# EAGLE design HES_Board_Rev1 (EAGLE 7.3.0)
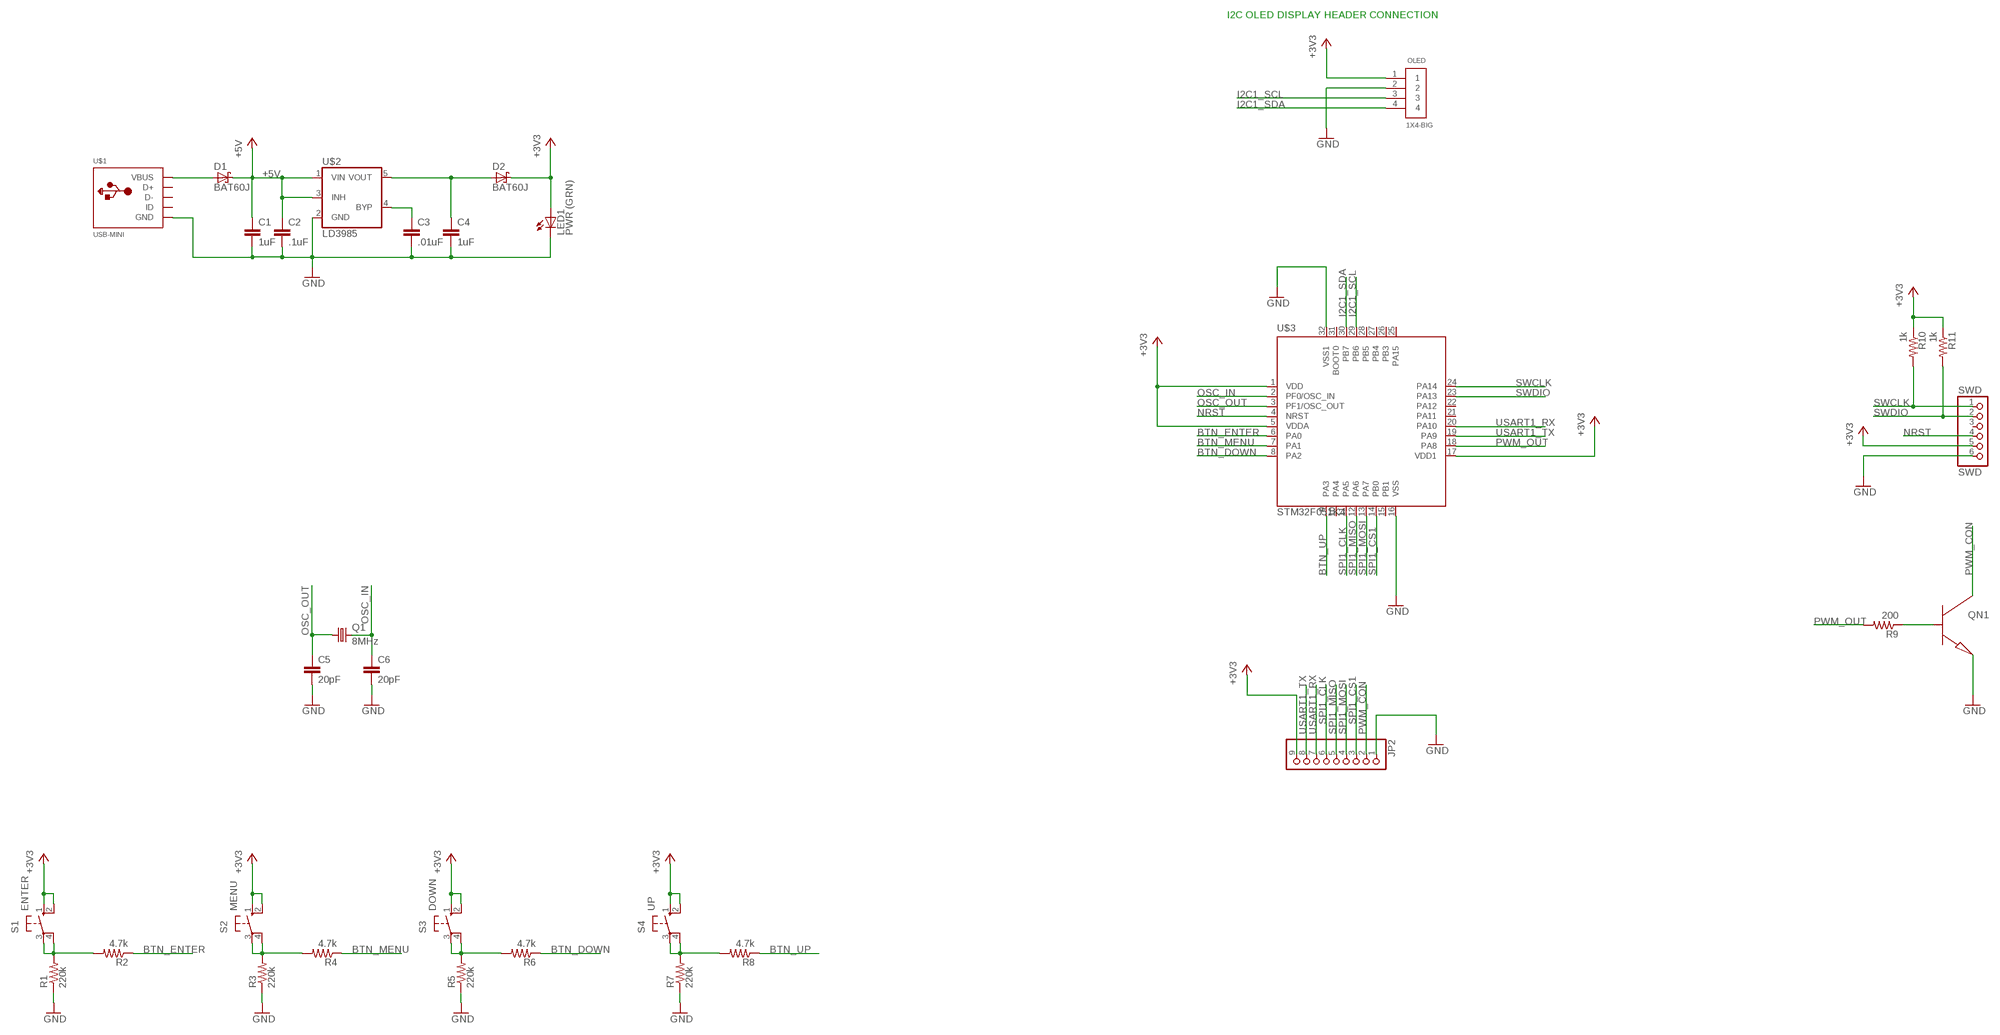
[diagram p0: schematic, sheet 1]

## Parts
C1  1uF  C-EUC0805  [C0805]
C2  .1uF  C-EUC0805  [C0805]
C3  .01uF  C-EUC0805  [C0805]
C4  1uF  C-EUC0805  [C0805]
C5  20pF  C-EUC0805  [C0805]
C6  20pF  C-EUC0805  [C0805]
D1  BAT60J  [SOD323_ST]
D2  BAT60J  [SOD323_ST]
JP2  PINHD-1X9  [1X09-BIG]
LED1  PWR (GRN)  LEDCHIP-LED0805  [CHIP-LED0805]
OLED  1X4-BIG  [1X04-BIG]
Q1  8MHz  CRYSTALHC49S  [HC49/S]
QN1  NPN  [SOT23]
R1  220k  R-US_R0805  [R0805]
R2  4.7k  R-US_R0805  [R0805]
R3  220k  R-US_R0805  [R0805]
R4  4.7k  R-US_R0805  [R0805]
R5  220k  R-US_R0805  [R0805]
R6  4.7k  R-US_R0805  [R0805]
R7  220k  R-US_R0805  [R0805]
R8  4.7k  R-US_R0805  [R0805]
R9  200  R-US_R0805  [R0805]
R10  1k  R-US_R0805  [R0805]
R11  1k  R-US_R0805  [R0805]
S1  ENTER  10-XX  [B3F-10XX]
S2  MENU  10-XX  [B3F-10XX]
S3  DOWN  10-XX  [B3F-10XX]
S4  UP  10-XX  [B3F-10XX]
SWD  SWD  PINHD-1X6B  [1X06-BIG]
U$1  USB-MINI  [USB-MINI]
U$2  LD3985  [SOT23-5L]
U$3  STM32F051K4  [LQFP32-7X7]

## Nets
+3V3: D2.C JP2.9 LED1.A OLED.1 R10.1 R11.1 S1.1(S) S1.2(S1) S2.1(S) S2.2(S1) S3.1(S) S3.2(S1) S4.1(S) S4.2(S1) SWD.5 U$3.1(VDD) U$3.5(VDDA) U$3.17(VDD1)
+5V: C1.1 C2.1 D1.C U$2.1(VIN) U$2.3(INH)
BTN_DOWN: R6.1 U$3.8(PA2)
BTN_ENTER: R2.1 U$3.6(PA0)
BTN_MENU: R4.1 U$3.7(PA1)
BTN_UP: R8.1 U$3.9(PA3)
GND: C1.2 C2.2 C3.2 C4.2 C5.2 C6.2 JP2.1 LED1.C OLED.2 QN1.1(E) R1.1 R3.1 R5.1 R7.1 SWD.6 U$1.GND U$2.2(GND) U$3.16(VSS) U$3.32(VSS1)
I2C1_SCL: OLED.3 U$3.29(PB6)
I2C1_SDA: OLED.4 U$3.30(PB7)
N$1: D1.A U$1.VBUS
N$2: C4.1 D2.A U$2.5(VOUT)
N$3: R5.2 R6.2 S3.3(P) S3.4(P1)
N$4: R1.2 R2.2 S1.3(P) S1.4(P1)
N$5: C3.1 U$2.4(BYP)
N$6: R7.2 R8.2 S4.3(P) S4.4(P1)
N$7: R3.2 R4.2 S2.3(P) S2.4(P1)
N$8: QN1.2(B) R9.1
NRST: SWD.4 U$3.4(NRST)
OSC_IN: C6.1 Q1.2 U$3.2(PF0/OSC_IN)
OSC_OUT: C5.1 Q1.1 U$3.3(PF1/OSC_OUT)
PWM_CON: JP2.2 QN1.3(C)
PWM_OUT: R9.2 U$3.18(PA8)
SPI1_CLK: JP2.6 U$3.11(PA5)
SPI1_CS1: JP2.3 U$3.14(PB0)
SPI1_MISO: JP2.5 U$3.12(PA6)
SPI1_MOSI: JP2.4 U$3.13(PA7)
SWCLK: R10.2 SWD.1 U$3.24(PA14)
SWDIO: R11.2 SWD.2 U$3.23(PA13)
USART1_RX: JP2.7 U$3.20(PA10)
USART1_TX: JP2.8 U$3.19(PA9)
Unconnected: SWD.3 U$1.D+ U$1.D- U$1.ID U$3.10(PA4) U$3.15(PB1) U$3.21(PA11) U$3.22(PA12) U$3.25(PA15) U$3.26(PB3) U$3.27(PB4) U$3.28(PB5) U$3.31(BOOT0)

## Notes on the sheet
- I2C OLED DISPLAY HEADER CONNECTION

## Library data of the parts
C1-C6 = resistor:C-EU: CAPACITOR, European symbol
D1 D2 = User-Custom:BAT60J: Schottky barrier diode Source: www.st.com, BAT60J.pdf
JP2 = adafruit:PINHD-1X9: Pin header 1x10 0.1" spacing With round pins
LED1 = adafruit:LED: LED OSRAM: - CHIPLED LG R971, LG N971, LY N971, LG Q971, LY Q971, LO R971, LY R971 LH N974, LH R974 LS Q976, LO Q976, LY Q976 LO Q996 - Hyper CHIPLED LW Q18S LB Q993, LB Q99A, LB R99A - SideLED LS A670, LO A670, LY A670, LG A670, LP A670 LB A673, LV A673, LT A673, LW A673 LH A674 LY A675 LS A676, LA A676, LO A676, LY A676, LW A676 LS A679, LY A679, LG A679 - Hyper Micro SIDELED® LS Y876, LA Y876, LO Y876, LY Y876 LT Y87S - SmartLED LW L88C, LW L88S LB L89C, LB L89S, LG L890 LS L89K, LO L89K, LY L89K LS L896, LA L896, LO L896, LY L896 - TOPLED LS T670, LO T670, LY T670, LG T670, LP T670 LSG T670, LSP T670, LSY T670, LOP T670, LYG T670 LG T671, LOG T671, LSG T671 LB T673, LV T673, LT T673, LW T673 LH T674 LS T676, LA T676, LO T676, LY T676, LB T676, LH T676, LSB T676, LW T676 LB T67C, LV T67C, LT T67C, LS T67K, LO T67K, LY T67K, LW E67C LS E67B, LA E67B, LO E67B, LY E67B, LB E67C, LV E67C, LT E67C LW T67C LS T679, LY T679, LG T679 LS T770, LO T770, LY T770, LG T770, LP T770 LB T773, LV T773, LT T773, LW T773 LH T774 LS E675, LA E675, LY E675, LS T675 LS T776, LA T776, LO T776, LY T776, LB T776 LHGB T686 LT T68C, LB T68C - Hyper Mini TOPLED® LB M676 - Mini TOPLED Santana® LG M470 LS M47K, LO M47K, LY M47K Source: http://www.osram.convergy.de/
OLED = adafruit:1X4: 4-pin connector
Q1 = User-Custom:CRYSTAL: CRYSTAL; OC_FARNELL: 1667008; OC_NEWARK: unknown
QN1 = User-Custom:NPN: Bipolar NPN transistor
R1-R11 = resistor:R-US_: RESISTOR, American symbol
S1-S4 = User-Custom:10-XX: OMRON SWITCH; MPN: B3F-1000; OC_FARNELL: 176432; OC_NEWARK: 36M3542
SWD = adafruit:PINHD-1X6: PIN HEADER
U$1 = User-Custom:USB-MINI: USB Mini Connector http://portal.fciconnect.com/Comergent//fci/drawing/10033526.pdf
U$2 = User-Custom:LD3985: LUltra low drop and low noise BiCMOS voltage regulators http://www.st.com/web/en/resource/technical/document/datasheet/CD00003395.pdf
U$3 = User-Custom:STM32F051K4

## Board
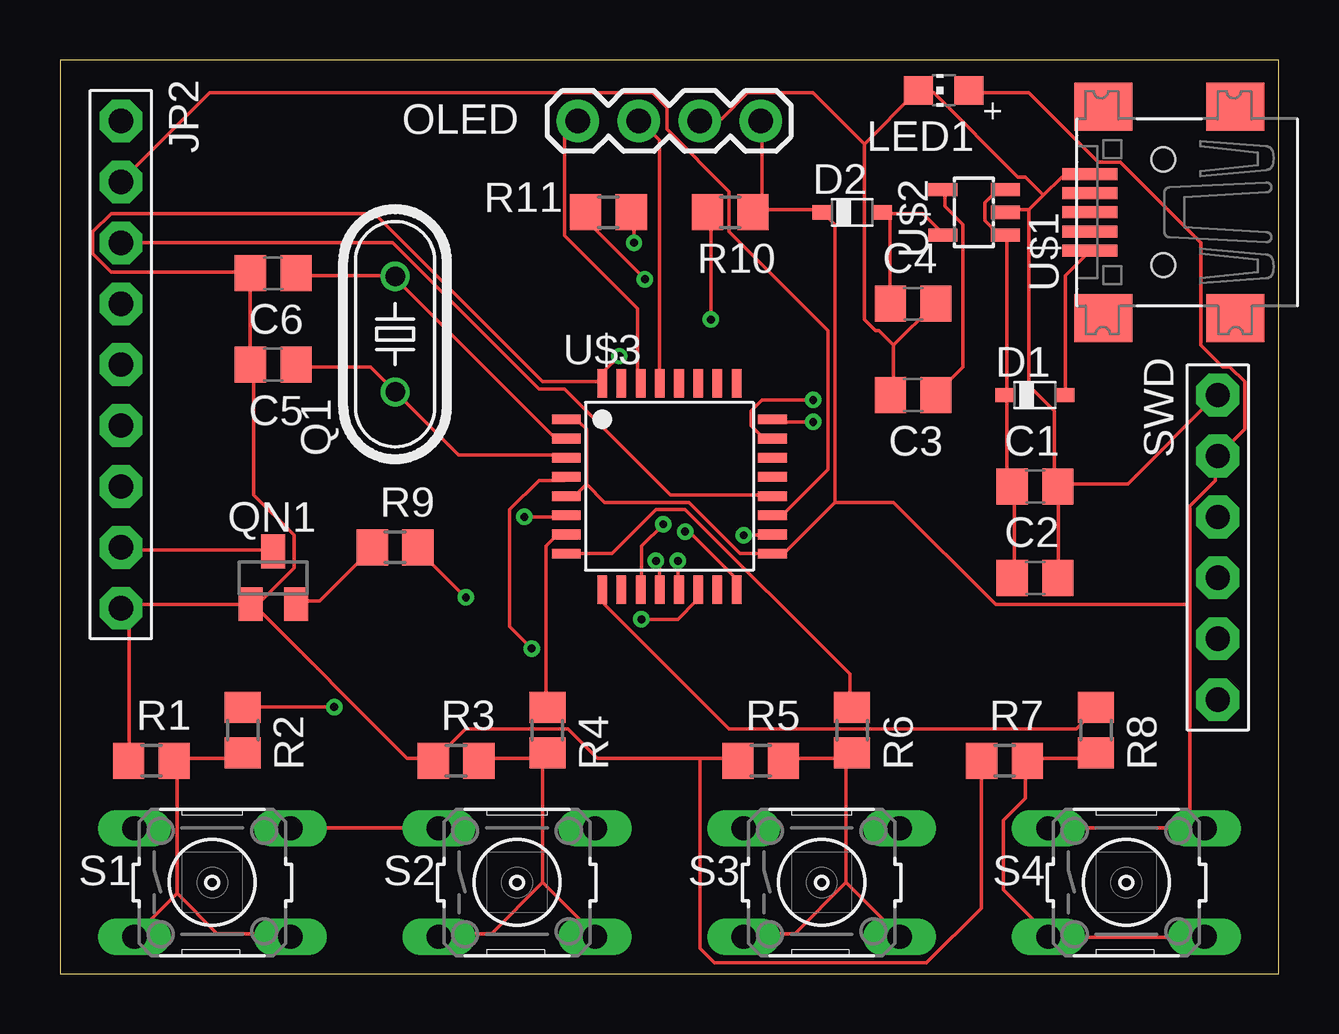
[diagram p1: board, top side]
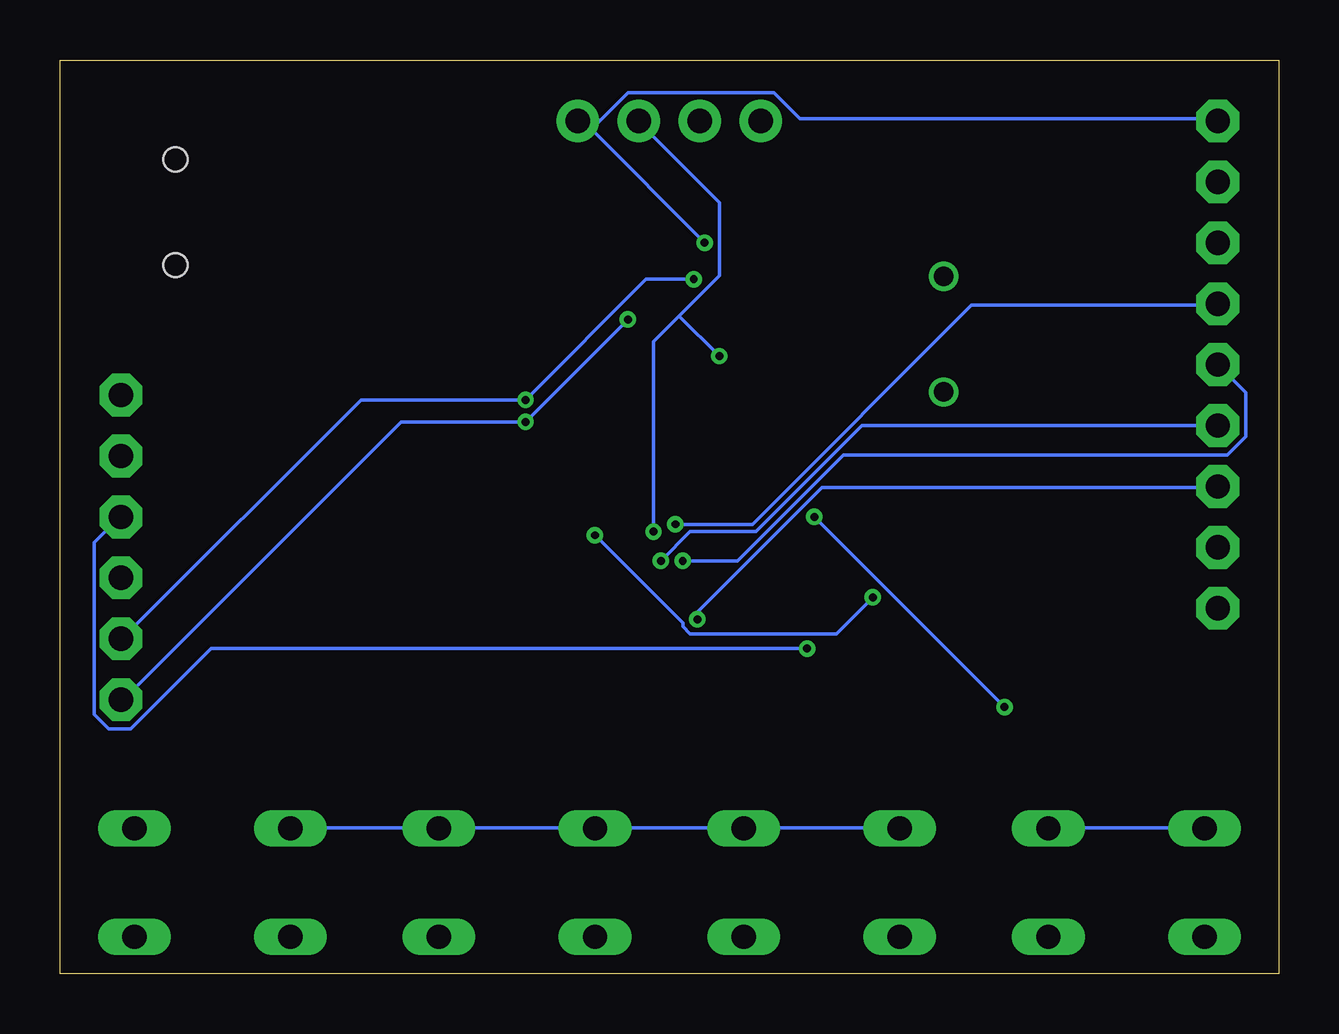
[diagram p2: board, bottom side, seen from below]

Size 50.8 x 38.1 mm. Coordinates in mm from the lower left corner, seen from the top.
Outline: 0,0 50.8,0 50.8,38.1 0,38.1 0,0
Copper layers (1*16): Top 0.0356mm / dielectric 1.5011mm / Bottom 0.0356mm
Design rules "LaenPCBOrder": minimum track width 6mil, minimum drill 13mil, track to track 6mil, track to pad 6mil, pad to pad 6mil, via to via 6mil, smd to smd 6mil, copper to edge 15mil, drill to drill 6mil, minimum pad ring 7mil, minimum via ring 7mil, stop-mask expansion 3mil, vias tented up to drill 0mil, thermal gap 10mil

### Footprints (pad centres in the part's own frame; a part is rotated, then mirrored left to right if it is on the bottom)
C0805 = smd 1.3 x 1.5: 1 -0.95,0; 2 0.95,0
SOD323_ST = smd 0.8 x 0.6: A 1.25,0; C -1.25,0
1X09-BIG = drill 1.016 pad 1.778 octagon: 1 -10.16,0; 2 -7.62,0; 3 -5.08,0; 4 -2.54,0; 5 0,0; 6 2.54,0; 7 5.08,0; 8 7.62,0; 9 10.16,0
CHIP-LED0805 = smd 1.2 x 1.2: A 0,-1.05; C 0,1.05
1X04-BIG = drill 1.016 pad 1.778: 1 0,0; 2 2.54,0; 3 5.08,0; 4 7.62,0
HC49/S = drill 0.813: 1 -2.413,0; 2 2.413,0
SOT23 = smd 1 x 1.4: 1 -0.95,-1.1; 2 0.95,-1.1; 3 0,1.1
R0805 = smd 1.3 x 1.5: 1 -0.95,0; 2 0.95,0
B3F-10XX = drill 1.016 long: 1 -3.251,2.261; 2 3.251,2.261; 3 -3.251,-2.261; 4 3.251,-2.261
1X06-BIG = drill 1.016 pad 1.778 octagon: 1 -6.35,0; 2 -3.81,0; 3 -1.27,0; 4 1.27,0; 5 3.81,0; 6 6.35,0
USB-MINI = smd 0.5 x 2.308: D+ 0,2.794; D- -0.8,2.794; GND 1.6,2.794; ID 0.8,2.794; VBUS -1.6,2.794 | smd 2 x 2.4: GND1 -4.4,-3.27; GND2 -4.4,2.23; GND3 4.4,2.23; GND4 4.4,-3.27 | hole 1: -2.2,-0.27; 2.2,-0.27
SOT23-5L = smd 0.55 x 1.2: 1 -0.95,-1.3; 2 0,-1.3; 3 0.95,-1.3; 4 0.95,1.3; 5 -0.95,1.3
LQFP32-7X7 = smd 1.2 x 0.4: 1 -4.3,2.8; 2 -4.3,2; 3 -4.3,1.2; 4 -4.3,0.4; 5 -4.3,-0.4; 6 -4.3,-1.2; 7 -4.3,-2; 8 -4.3,-2.8; 17 4.3,-2.8; 18 4.3,-2; 19 4.3,-1.2; 20 4.3,-0.4; 21 4.3,0.4; 22 4.3,1.2; 23 4.3,2; 24 4.3,2.8 | smd 0.4 x 1.2: 9 -2.8,-4.3; 10 -2,-4.3; 11 -1.2,-4.3; 12 -0.4,-4.3; 13 0.4,-4.3; 14 1.2,-4.3; 15 2,-4.3; 16 2.8,-4.3; 25 2.8,4.3; 26 2,4.3; 27 1.2,4.3; 28 0.4,4.3; 29 -0.4,4.3; 30 -1.2,4.3; 31 -2,4.3; 32 -2.8,4.3

### Placement (x,y rotation side)
C1  40.64,20.32 0 top
C2  40.64,16.51 0 top
C3  35.56,24.13 180 top
C4  35.56,27.94 0 top
C5  8.89,25.4 180 top
C6  8.89,29.21 180 top
D1  40.64,24.13 0 top
D2  33.02,31.75 0 top
JP2  2.54,25.4 90 top
LED1  36.83,36.83 90 top
OLED  29.21,35.56 180 top
Q1  13.97,26.67 90 top
QN1  8.89,16.51 0 top
R1  3.81,8.89 0 top
R2  7.62,10.16 270 top
R3  16.51,8.89 0 top
R4  20.32,10.16 270 top
R5  29.21,8.89 0 top
R6  33.02,10.16 270 top
R7  39.37,8.89 0 top
R8  43.18,10.16 270 top
R9  13.97,17.78 0 top
R10  27.94,31.75 180 top
R11  22.86,31.75 180 top
S1  6.35,3.81 0 top
S2  19.05,3.81 0 top
S3  31.75,3.81 0 top
S4  44.45,3.81 0 top
SWD  48.26,17.78 90 top
U$1  45.72,31.75 90 top
U$2  38.1,31.75 90 top
U$3  25.4,20.32 0 top

### Tracks (layer width: path | path; a pad name or v marks a point on that pad's centre or on a via)
+3V3  (via drill 0.33)
  Top 0.152: 21.95,20.42 21.49,19.96 21.18,19.96 U$3.5 | 21.95,20.42 21.95,22.71 21.64,23.01 21.18,23.01 U$3.1 | 21.95,20.42 22.71,19.66 26.21,19.66 28.35,17.53 29.57,17.53 U$3.17 29.72,17.53 30.18,17.53 32.31,19.66 | 29.26,31.85 28.96,31.85 R10.1 29.26,31.85 | 29.26,31.85 31.7,31.85 D2.C 31.85,31.7 32.31,31.24 32.31,19.66 | v23.93,30.48 23.93,31.7 R11.1 | 29.26,31.85 29.26,35.51 OLED.1 | LED1.A 37.95,36.73 40.39,36.73 43.28,33.83 44.2,33.83 47.55,30.48 47.55,26.21 48.46,25.3 48.77,25.3 49.38,24.69 49.38,22.71 SWD.5 48.16,21.49 48.16,20.57 47.09,19.51 47.09,15.39 | 47.09,6.1 41.3,6.1 S4.1 | 47.09,6.1 47.7,6.1 S4.2 47.09,6.1 | S2.1 15.7,6.1 9.6,6.1 S1.2 | 47.09,6.1 47.09,15.39 | 32.31,19.66 34.75,19.66 39.01,15.39 47.09,15.39
  Bottom 0.152: 28.65,35.2 29.11,35.66 OLED.1 28.65,35.2 | 28.65,35.2 v23.93,30.48 | 28.65,35.2 27.13,36.73 21.03,36.73 19.96,35.66 2.59,35.66 JP2.9 | S4.1 41.15,6.1 35.05,6.1 S3.2 34.9,6.1 28.5,6.1 | 28.5,6.1 22.4,6.1 S2.2 22.25,6.1 15.85,6.1 S2.1 | S1.1 3.2,6.1 9.6,6.1 S1.2 | 28.5,6.1 S3.1
+5V
  Top 0.152: U$2.3 39.32,32.61 39.01,32.61 38.56,32.16 38.56,31.39 39.01,30.94 39.32,30.94 U$2.1 39.47,30.79 39.47,24.23 D1.C 39.47,24.08 39.47,20.57 39.62,20.42 C1.1 39.78,20.27 39.78,16.61 C2.1
BTN_DOWN
  Top 0.152: U$3.8 21.18,17.53 23.01,17.53 24.84,19.36 26.06,19.36 32.92,12.5 32.92,11.12 R6.1
BTN_ENTER  (via drill 0.33)
  Top 0.152: v19.36,19.05 21.03,19.05 U$3.6 | v11.43,11.12 7.62,11.12 R2.1
  Bottom 0.152: v11.43,11.12 v19.36,19.05
BTN_MENU
  Top 0.152: U$3.7 21.03,18.29 20.73,18.29 20.27,17.83 20.27,11.12 R4.1
BTN_UP
  Top 0.152: U$3.9 22.71,16 22.71,15.39 27.89,10.21 42.37,10.21 43.13,10.97 R8.1
GND  (via drill 0.33)
  Top 0.152: v26.06,18.44 26.21,18.44 28.19,16.46 28.19,16.15 U$3.16 | C2.2 41.6,16.61 41.6,20.27 C1.2 | C1.2 41.6,20.42 44.5,20.42 48.16,24.08 SWD.6 | 34.75,26.21 34.75,24.23 C3.2 | 34.75,26.21 36.42,27.89 C4.2 | 40.39,31.85 39.47,31.85 U$2.2 | 41,32.46 41.76,33.22 42.82,33.22 U$1.GND | 41,32.46 40.39,31.85 | 41,32.46 40.23,33.22 39.93,33.22 36.42,36.73 35.81,36.73 LED1.C 35.66,36.73 33.53,34.59 | 34.75,26.21 34.14,26.82 33.98,26.82 33.53,27.28 33.53,34.59 | 40.39,31.85 40.39,24.54 41.45,23.47 41.45,20.42 C1.2 | 33.53,34.59 31.39,36.73 28.65,36.73 27.58,35.66 26.67,35.66 OLED.2 | 2.9,15.39 2.74,15.39 2.59,15.24 JP2.1 2.9,15.39 | 2.9,15.39 7.92,15.39 QN1.1 | 2.9,15.39 2.9,8.99 R1.1 | QN1.1 8.08,15.39 14.48,8.99 15.54,8.99 R3.1 15.7,8.99 16.92,10.21 21.18,10.21 22.4,8.99 26.67,8.99 | 26.67,8.99 28.19,8.99 R5.1 | 26.67,8.99 26.67,1.07 27.28,0.46 36.12,0.46 38.41,2.74 38.41,8.84 R7.1 | QN1.1 8.08,15.54 8.38,15.54 9.75,16.92 9.75,18.29 8.08,19.96 8.08,25.3 C5.2 7.92,25.45 7.92,29.11 C6.2 7.92,29.26 2.13,29.26 1.37,30.02 1.37,30.94 2.13,31.7 13.11,31.7 20.12,24.69 22.55,24.69 U$3.32 22.71,24.69 22.71,25.15 v23.32,25.76
  Bottom 0.152: v26.06,18.44 26.06,26.36 24.99,27.43 | 24.99,27.43 23.32,29.11 23.32,32.16 26.67,35.51 OLED.2 | v23.32,25.76 24.99,27.43
I2C1_SCL
  Top 0.152: U$3.29 24.99,24.69 24.99,34.75 24.23,35.51 OLED.3
I2C1_SDA
  Top 0.152: U$3.30 24.08,24.69 24.08,27.74 21.03,30.79 21.03,35.05 21.49,35.51 OLED.4
N$1
  Top 0.152: D1.A 41.91,24.23 41.91,29.11 42.82,30.02 U$1.VBUS
N$2
  Top 0.152: 34.59,31.7 35.97,31.7 36.73,30.94 U$2.5 | 34.59,31.7 34.29,31.7 D2.A 34.59,31.7 | 34.59,31.7 34.59,28.04 C4.1
N$3
  Top 0.152: 32.77,8.99 30.18,8.99 R5.2 | 32.77,8.99 32.92,9.14 R6.2 32.77,8.99 | 32.77,3.81 32.77,8.99 | 32.77,3.81 34.9,1.68 S3.4 | 32.77,3.81 30.63,1.68 28.5,1.68 S3.3
N$4
  Top 0.152: R2.2 7.62,9.14 7.47,8.99 4.88,8.99 R1.2 4.88,8.84 4.88,3.35 | 4.88,3.35 3.2,1.68 S1.3 | 4.88,3.35 6.55,1.68 9.6,1.68 S1.4
N$5
  Top 0.152: U$2.4 36.88,32.61 36.88,32 37.64,31.24 37.64,25.3 36.58,24.23 C3.1
N$6
  Top 0.152: R8.2 43.13,9.14 42.98,8.99 40.39,8.99 R7.2 40.23,8.84 40.23,7.32 39.32,6.4 39.32,3.5 41.15,1.68 S4.3 41.3,1.52 47.7,1.52 S4.4
N$7
  Top 0.152: 20.12,8.99 17.53,8.99 R3.2 | 20.12,8.99 20.27,9.14 R4.2 20.12,8.99 | 20.12,3.81 20.12,8.99 | 20.12,3.81 22.25,1.68 S2.4 | 20.12,3.81 17.98,1.68 15.85,1.68 S2.3
N$8
  Top 0.152: QN1.2 9.91,15.54 10.82,15.54 12.95,17.68 R9.1
NRST  (via drill 0.33)
  Top 0.152: v19.66,13.56 18.75,14.48 18.75,19.36 19.96,20.57 21.03,20.57 U$3.4
  Bottom 0.152: v19.66,13.56 44.5,13.56 47.85,10.21 48.77,10.21 49.38,10.82 49.38,17.98 48.31,19.05 SWD.4
OSC_IN
  Top 0.152: U$3.2 21.03,22.4 20.57,22.4 14.02,28.96 Q1.2 13.87,29.11 9.91,29.11 C6.1
OSC_OUT
  Top 0.152: U$3.3 21.03,21.64 16.61,21.64 14.02,24.23 Q1.1 13.87,24.38 12.95,25.3 9.91,25.3 C5.1
PWM_CON
  Top 0.152: QN1.3 8.84,17.68 2.59,17.68 JP2.2
PWM_OUT  (via drill 0.33)
  Top 0.152: v28.5,18.29 29.57,18.29 U$3.18 | v16.92,15.7 14.94,17.68 R9.2
  Bottom 0.152: v28.5,18.29 24.84,14.63 24.84,14.48 24.54,14.17 18.44,14.17 v16.92,15.7
SPI1_CLK  (via drill 0.33)
  Top 0.152: v25.15,18.75 24.23,17.83 24.23,16.15 U$3.11
  Bottom 0.152: v25.15,18.75 21.95,18.75 12.8,27.89 2.59,27.89 JP2.6
SPI1_CS1  (via drill 0.33)
  Top 0.152: v24.23,14.78 25.76,14.78 26.52,15.54 26.52,16 U$3.14
  Bottom 0.152: v24.23,14.78 24.23,15.09 19.05,20.27 2.59,20.27 JP2.3
SPI1_MISO  (via drill 0.33)
  Top 0.152: v24.84,17.22 24.99,17.07 24.99,16.15 U$3.12
  Bottom 0.152: v24.84,17.22 22.55,17.22 18.14,21.64 2.13,21.64 1.37,22.4 1.37,24.23 JP2.5
SPI1_MOSI  (via drill 0.33)
  Top 0.152: v25.76,17.22 25.76,16.15 U$3.13
  Bottom 0.152: v25.76,17.22 24.54,18.44 21.79,18.44 17.37,22.86 JP2.4
SWCLK  (via drill 0.33)
  Top 0.152: v31.39,23.01 29.72,23.01 U$3.24 | v27.13,27.28 27.13,31.7 R10.2
  Bottom 0.152: SWD.1 48.16,11.43 36.58,23.01 v31.39,23.01 v27.13,27.28
SWDIO  (via drill 0.33)
  Top 0.152: v31.39,23.93 29.26,23.93 28.8,23.47 28.8,22.86 29.26,22.4 29.57,22.4 U$3.23 | v24.38,28.96 21.95,31.39 21.95,31.7 R11.2
  Bottom 0.152: SWD.2 48.16,14.02 38.25,23.93 v31.39,23.93 26.36,28.96 v24.38,28.96
USART1_RX
  Top 0.152: JP2.7 13.87,30.48 19.96,24.38 21.03,24.38 25.45,19.96 29.57,19.96 U$3.20
USART1_TX
  Top 0.152: JP2.8 6.25,36.73 24.69,36.73 25.3,36.12 25.3,35.2 27.89,32.61 27.89,30.94 32,26.82 32,21.03 30.18,19.2 29.72,19.2 U$3.19